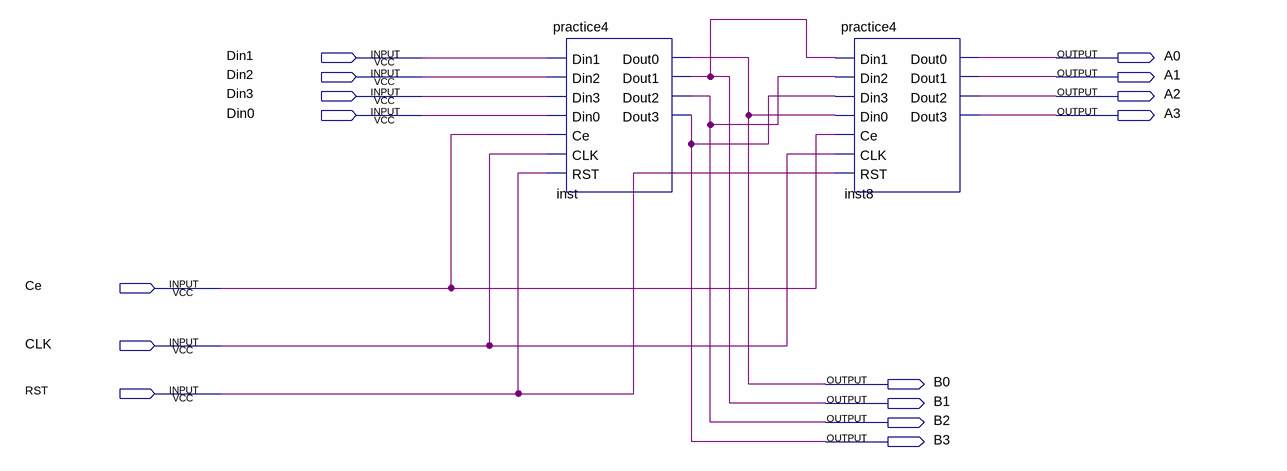
[diagram p0: schematic sheet]
// Quartus schematic practice5.bdf as structural Verilog: 2 symbols, 15 pins
module practice5 (
  input  Din1,
  input  Din2,
  input  Din3,
  input  Din0,
  input  Ce,
  input  CLK,
  input  RST,
  output A0,
  output A1,
  output A2,
  output A3,
  output B0,
  output B1,
  output B2,
  output B3
);

  practice4 inst (
    .Din1(Din1), .Din2(Din2), .Din3(Din3), .Din0(Din0), .Ce(Ce), .CLK(CLK), .RST(RST), .Dout0(B0),
    .Dout1(B1), .Dout2(B2), .Dout3(B3));
  practice4 inst8 (
    .Din1(B1), .Din2(B2), .Din3(B3), .Din0(B0), .Ce(Ce), .CLK(CLK), .RST(RST), .Dout0(A0), .Dout1(A1),
    .Dout2(A2), .Dout3(A3));
endmodule
